# EAGLE design OsciloscopioVersãoFinal (EAGLE 9.4.2)
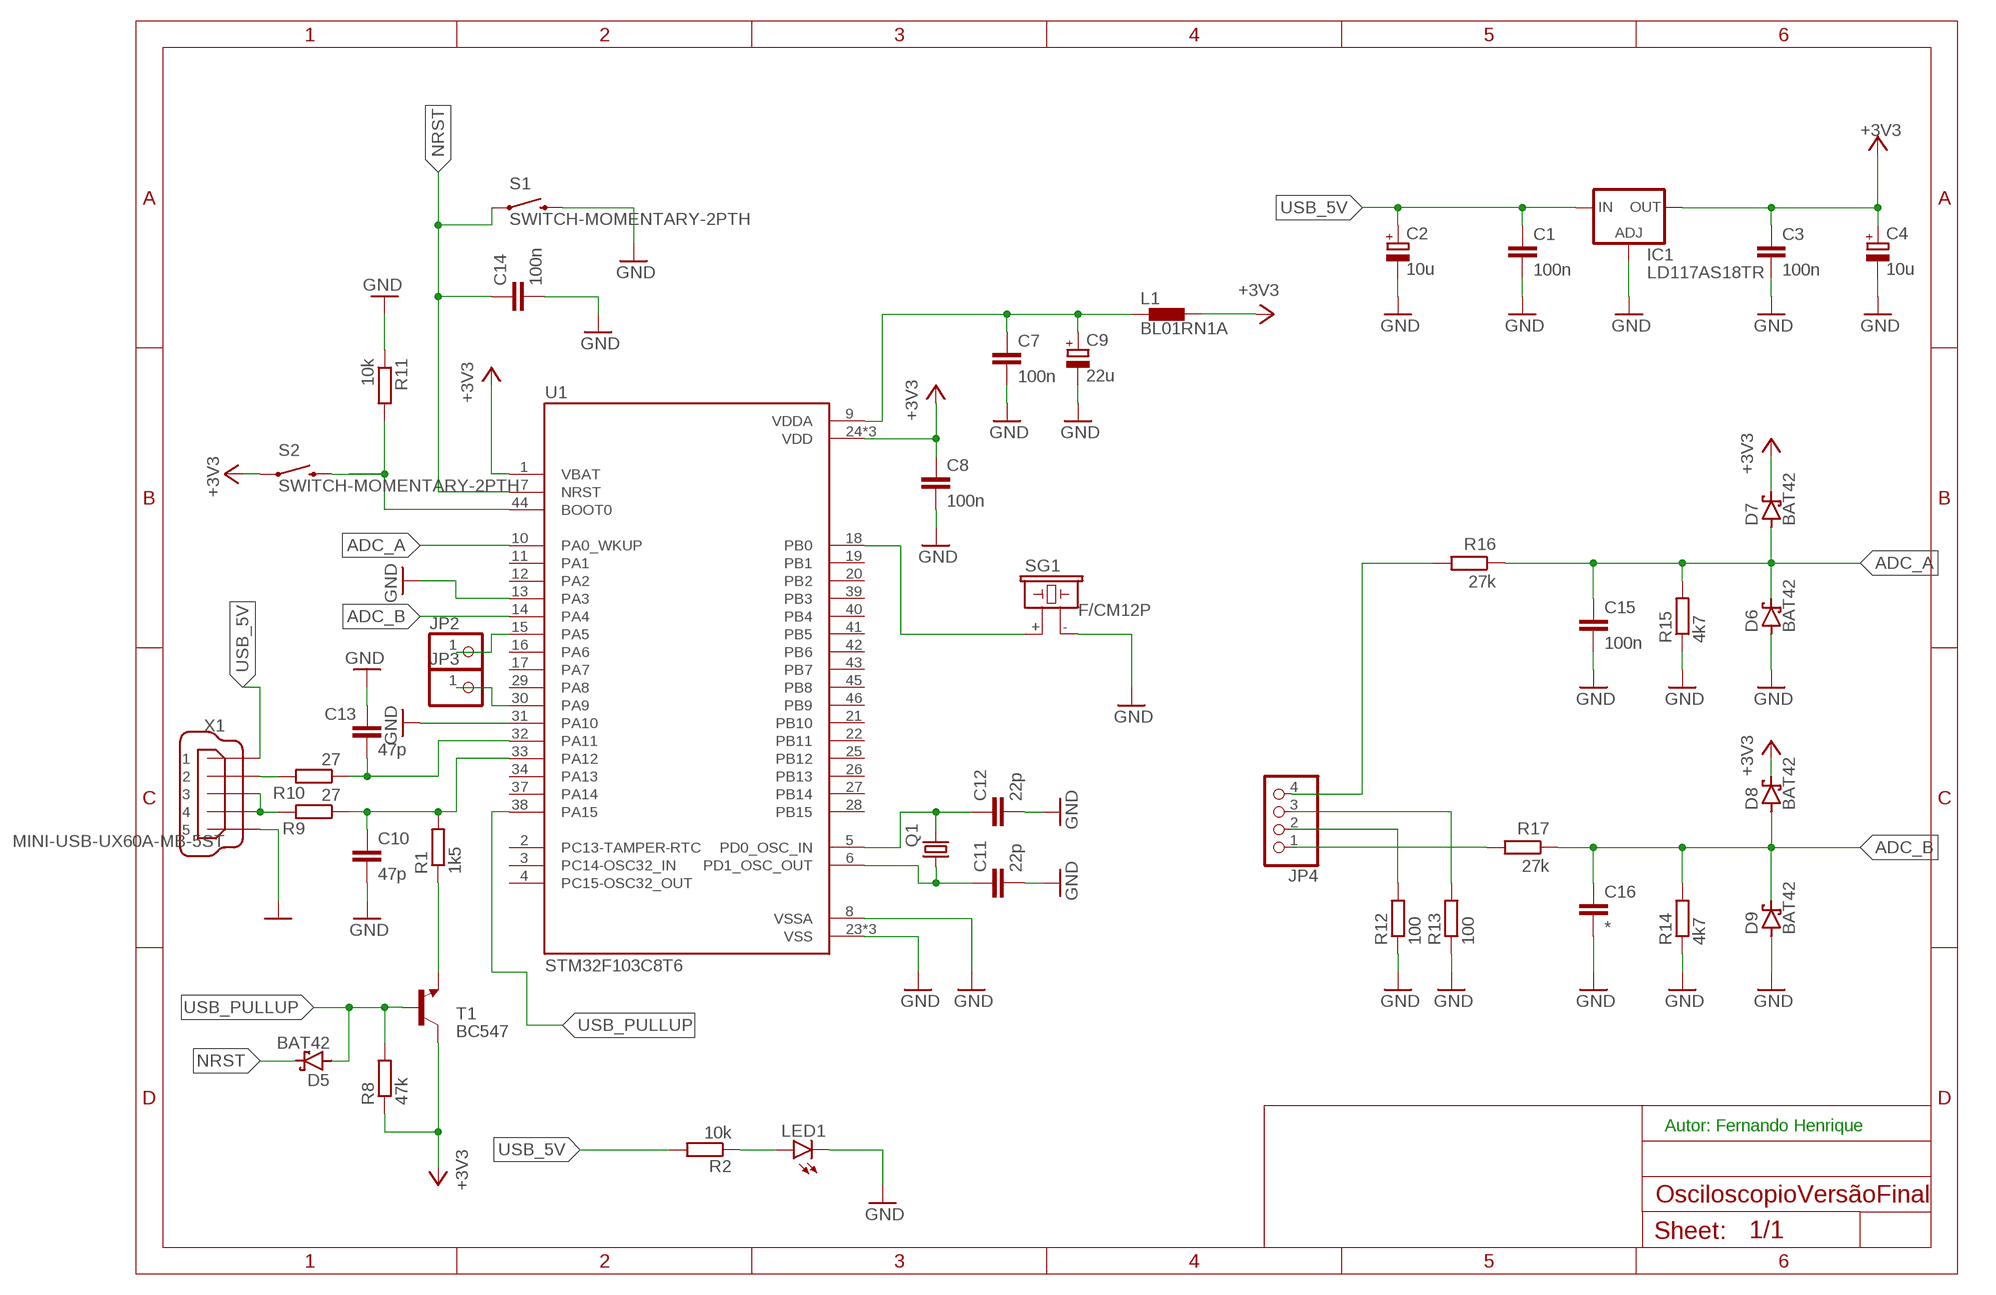
[diagram p0: schematic, sheet 1]

## Parts
C1  100n  C-EUC1206  [C1206]
C2  10u  CPOL-EUB45181B  [B45181B]
C3  100n  C-EUC1206  [C1206]
C4  10u  CPOL-EUB45181B  [B45181B]
C7  100n  C-EUC1206  [C1206]
C8  100n  C-EUC1206  [C1206]
C9  22u  CPOL-EUB45181B  [B45181B]
C10  47p  C-EUC1206  [C1206]
C11  22p  C-EUC1206  [C1206]
C12  22p  C-EUC1206  [C1206]
C13  47p  C-EUC1206  [C1206]
C14  100n  C-EUC1206  [C1206]
C15  100n  C-EUC1206  [C1206]
C16  *  C-EUC1206  [C1206]
D5  BAT42  [DO35-10]
D6  BAT42  [DO35-10]
D7  BAT42  [DO35-10]
D8  BAT42  [DO35-10]
D9  BAT42  [DO35-10]
IC1  LD117AS18TR  [SOT223]
JP2  PINHD-1X1  [1X01]
JP3  PINHD-1X1  [1X01]
JP4  PINHD-1X4  [1X04]
L1  BL01RN1A  [BL01RN1A]
LED1  LED3MM  [LED3MM]
Q1  CRYSTALHC49U-V  [HC49U-V]
R1  1k5  R-EU_R1206  [R1206]
R2  10k  R-EU_R1206  [R1206]
R8  47k  R-EU_R1206  [R1206]
R9  27  R-EU_R1206  [R1206]
R10  27  R-EU_R1206  [R1206]
R11  10k  R-EU_R1206  [R1206]
R12  100  R-EU_R1206  [R1206]
R13  100  R-EU_R1206  [R1206]
R14  4k7  R-EU_R1206  [R1206]
R15  4k7  R-EU_R1206  [R1206]
R16  27k  R-EU_R1206  [R1206]
R17  27k  R-EU_R1206  [R1206]
S1  SWITCH-MOMENTARY-2PTH  [TACTILE-PTH]
S2  SWITCH-MOMENTARY-2PTH  [TACTILE-PTH]
SG1  F/CM12P  [F/CM12P]
T1  BC547  [TO92]
U1  STM32F103C8T6  [QFP50P900X900X160-48N]
X1  MINI-USB-UX60A-MB-5ST  [UX60A-MB-5ST]

## Nets
+3V3: C3.1 C4.+ C8.1 D7.C D8.C IC1.4(OUT) L1.2 R8.1 S2.1 T1.3(C) U1.1(VBAT) U1.24(VDD) U1.36(VDD) U1.48(VDD)
ADC_A: C15.1 D6.C D7.A R15.2 R16.1 U1.10(PA0_WKUP)
ADC_B: C16.1 D8.A D9.C R14.2 R17.1 U1.14(PA4)
GND: C1.2 C2.- C3.2 C4.- C7.2 C8.2 C9.- C10.2 C11.2 C12.2 C13.1 C14.2 C15.2 C16.2 D6.A D9.A IC1.1(ADJ) LED1.K(C) R11.1 R12.1 R13.1 R14.1 R15.1 S1.3 SG1.- U1.8(VSSA) U1.13(PA3) U1.23(VSS) U1.31(PA10) U1.35(VSS) U1.47(VSS) X1.5
N$1: LED1.A R2.1
N$5: SG1.+ U1.18(PB0)
N$6: C13.2 R10.1 U1.32(PA11)
N$7: C10.1 R1.2 R9.1 U1.33(PA12)
N$8: C7.1 C9.+ L1.1 U1.9(VDDA)
N$9: C11.1 Q1.1 U1.6(PD1_OSC_OUT)
N$10: C12.1 Q1.2 U1.5(PD0_OSC_IN)
N$11: R1.1 T1.1(E)
N$12: R10.2 X1.2
N$13: R9.2 X1.3 X1.4
N$14: JP2.1 U1.15(PA5)
N$15: JP3.1 U1.30(PA9)
N$16: R11.2 S2.3 U1.44(BOOT0)
N$17: JP4.1 R17.2
N$18: JP4.2 R12.2
N$19: JP4.3 R13.2
N$20: JP4.4 R16.2
NRST: C14.1 D5.C S1.1 U1.7(NRST)
USB_5V: C1.1 C2.+ IC1.3(IN) R2.2 X1.1
USB_PULLUP: D5.A R8.2 T1.2(B) U1.38(PA15)
Unconnected: U1.2(PC13-TAMPER-RTC) U1.3(PC14-OSC32_IN) U1.4(PC15-OSC32_OUT) U1.11(PA1) U1.12(PA2) U1.16(PA6) U1.17(PA7) U1.19(PB1) U1.20(PB2) U1.21(PB10) U1.22(PB11) U1.25(PB12) U1.26(PB13) U1.27(PB14) U1.28(PB15) U1.29(PA8) U1.34(PA13) U1.37(PA14) U1.39(PB3) U1.40(PB4) U1.41(PB5) U1.42(PB6) U1.43(PB7) U1.45(PB8) U1.46(PB9)

## Notes on the sheet
- Autor: Fernando Henrique

## Library data of the parts
C1 C3 C7 C8 C10-C16 = rcl:C-EU: CAPACITOR, European symbol; SPICEPREFIX: C
C2 C4 C9 = rcl:CPOL-EU: POLARIZED CAPACITOR, European symbol; SPICEPREFIX: C
D5-D9 = diode:BAT42: DIODE barrier diode
IC1 = v-reg:LD117A?*: Low drop fixed and adjustable positive voltage regulators 1 A Source: http://www.st.com/stonline/products/literature/ds/7194/ld1117axx.pdf
JP2 JP3 = pinhead:PINHD-1X1: PIN HEADER
JP4 = pinhead:PINHD-1X4: PIN HEADER
L1 = inductors:BL0: Noise Suppression Products/EMI Suppression Filters, Lead EMIFIL(R) Inductor Type Source: http://www.murata.com .. BL01RN1_DS.pdf
LED1 = led:LED: LED OSRAM: - CHIPLED LG R971, LG N971, LY N971, LG Q971, LY Q971, LO R971, LY R971 LH N974, LH R974 LS Q976, LO Q976, LY Q976 LO Q996 - Hyper CHIPLED LW Q18S LB Q993, LB Q99A, LB R99A - SideLED LS A670, LO A670, LY A670, LG A670, LP A670 LB A673, LV A673, LT A673, LW A673 LH A674 LY A675 LS A676, LA A676, LO A676, LY A676, LW A676 LS A679, LY A679, LG A679 - Hyper Micro SIDELED® LS Y876, LA Y876, LO Y876, LY Y876 LT Y87S - SmartLED LW L88C, LW L88S LB L89C, LB L89S, LG L890 LS L89K, LO L89K, LY L89K LS L896, LA L896, LO L896, LY L896 - TOPLED LS T670, LO T670, LY T670, LG T670, LP T670 LSG T670, LSP T670, LSY T670, LOP T670, LYG T670 LG T671, LOG T671, LSG T671 LB T673, LV T673, LT T673, LW T673 LH T674 LS T676, LA T676, LO T676, LY T676, LB T676, LH T676, LSB T676, LW T676 LB T67C, LV T67C, LT T67C, LS T67K, LO T67K, LY T67K, LW E67C LS E67B, LA E67B, LO E67B, LY E67B, LB E67C, LV E67C, LT E67C LW T67C LS T679, LY T679, LG T679 LS T770, LO T770, LY T770, LG T770, LP T770 LB T773, LV T773, LT T773, LW T773 LH T774 LS E675, LA E675, LY E675, LS T675 LS T776, LA T776, LO T776, LY T776, LB T776 LHGB T686 LT T68C, LB T68C - Hyper Mini TOPLED® LB M676 - Mini TOPLED Santana® LG M470 LS M47K, LO M47K, LY M47K Source: http://www.osram.convergy.de LUXEON: - LUMILED® LXK2-PW12-R00, LXK2-PW12-S00, LXK2-PW14-U00, LXK2-PW14-V00 LXK2-PM12-R00, LXK2-PM12-S00, LXK2-PM14-U00 LXK2-PE12-Q00, LXK2-PE12-R00, LXK2-PE12-S00, LXK2-PE14-T00, LXK2-PE14-U00 LXK2-PB12-K00, LXK2-PB12-L00, LXK2-PB12-M00, LXK2-PB14-N00, LXK2-PB14-P00, LXK2-PB14-Q00 LXK2-PR12-L00, LXK2-PR12-M00, LXK2-PR14-Q00, LXK2-PR14-R00 LXK2-PD12-Q00, LXK2-PD12-R00, LXK2-PD12-S00 LXK2-PH12-R00, LXK2-PH12-S00 LXK2-PL12-P00, LXK2-PL12-Q00, LXK2-PL12-R00 Source: www.luxeon.com KINGBRIGHT: KA-3528ASYC Source: www.kingbright.com
Q1 = crystal:CRYSTAL: CRYSTAL; OC_FARNELL: 1666969; OC_NEWARK: unknown
R1 R2 R8-R17 = rcl:R-EU_: RESISTOR, European symbol; SPICEPREFIX: R
S1 S2 = SparkFun-Electromechanical:SWITCH-MOMENTARY-2: Various NO switches- pushbuttons, reed, etc; PROD_ID: SWCH-08441
SG1 = buzzer:F/CM12P: BUZZER Source: Buerklin; OC_FARNELL: unknown; OC_NEWARK: unknown
T1 = transistor:BC547: NPN TRANSISTOR
U1 = STM32F103C8T6:STM32F103C8T6: Mainstream Performance line, ARM Cortex-M3 MCU with 64 Kbytes Flash, 72 MHz CPU, motor control, USB and CAN; DESCRIPTION: Mainstream Performance line, ARM Cortex-M3 MCU with 64 Kbytes Flash, 72 MHz CPU, motor control, USB and CAN; DIGI-KEY_PART_NUMBER: 497-6063-ND; DIGI-KEY_PURCHASE_URL: https://www.digikey.com.br/product-detail/en/stmicroelectronics/STM32F103C8T6/497-6063-ND/1646338?utm_source=snapeda&utm_medium=aggregator&utm_campaign=symbol; MF: STMicroelectronics; MP: STM32F103C8T6; PACKAGE: LQFP-48 STMicroelectronics
X1 = con-hirose:MINI-USB-: MINI USB Connector Source: http://www.hirose.co.jp/cataloge_hp/e24000019.pdf; OC_FARNELL: unknown; OC_NEWARK: unknown

## Board
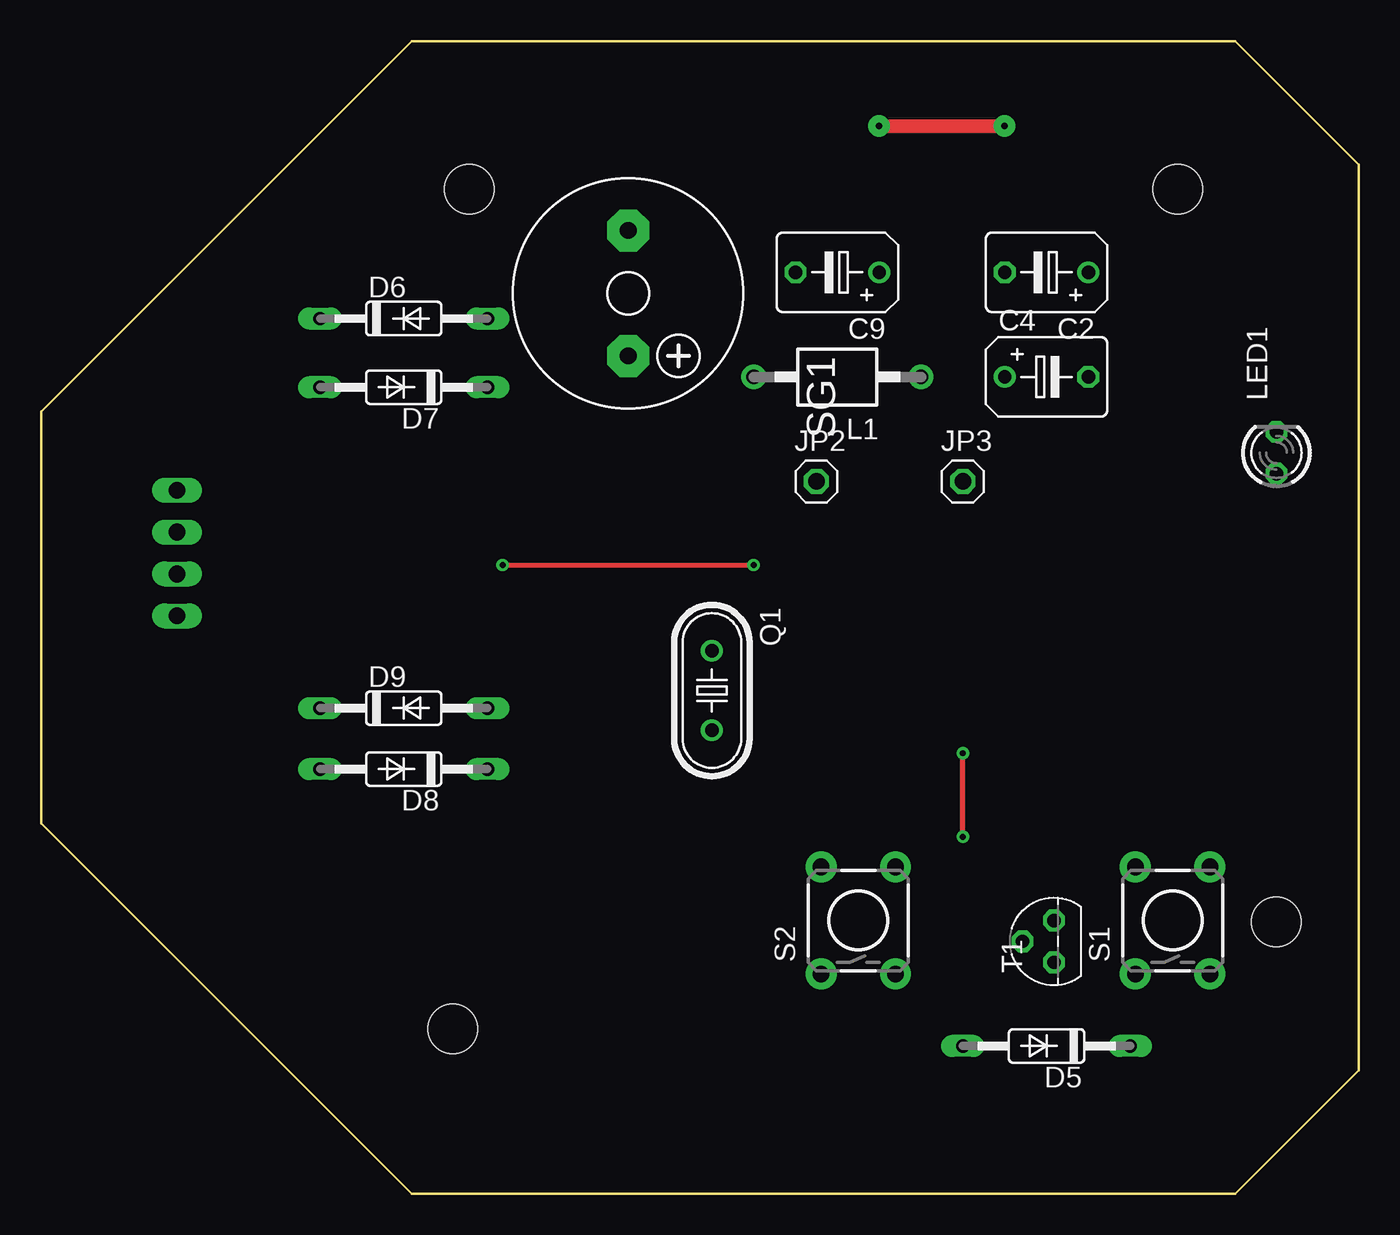
[diagram p1: board, top side]
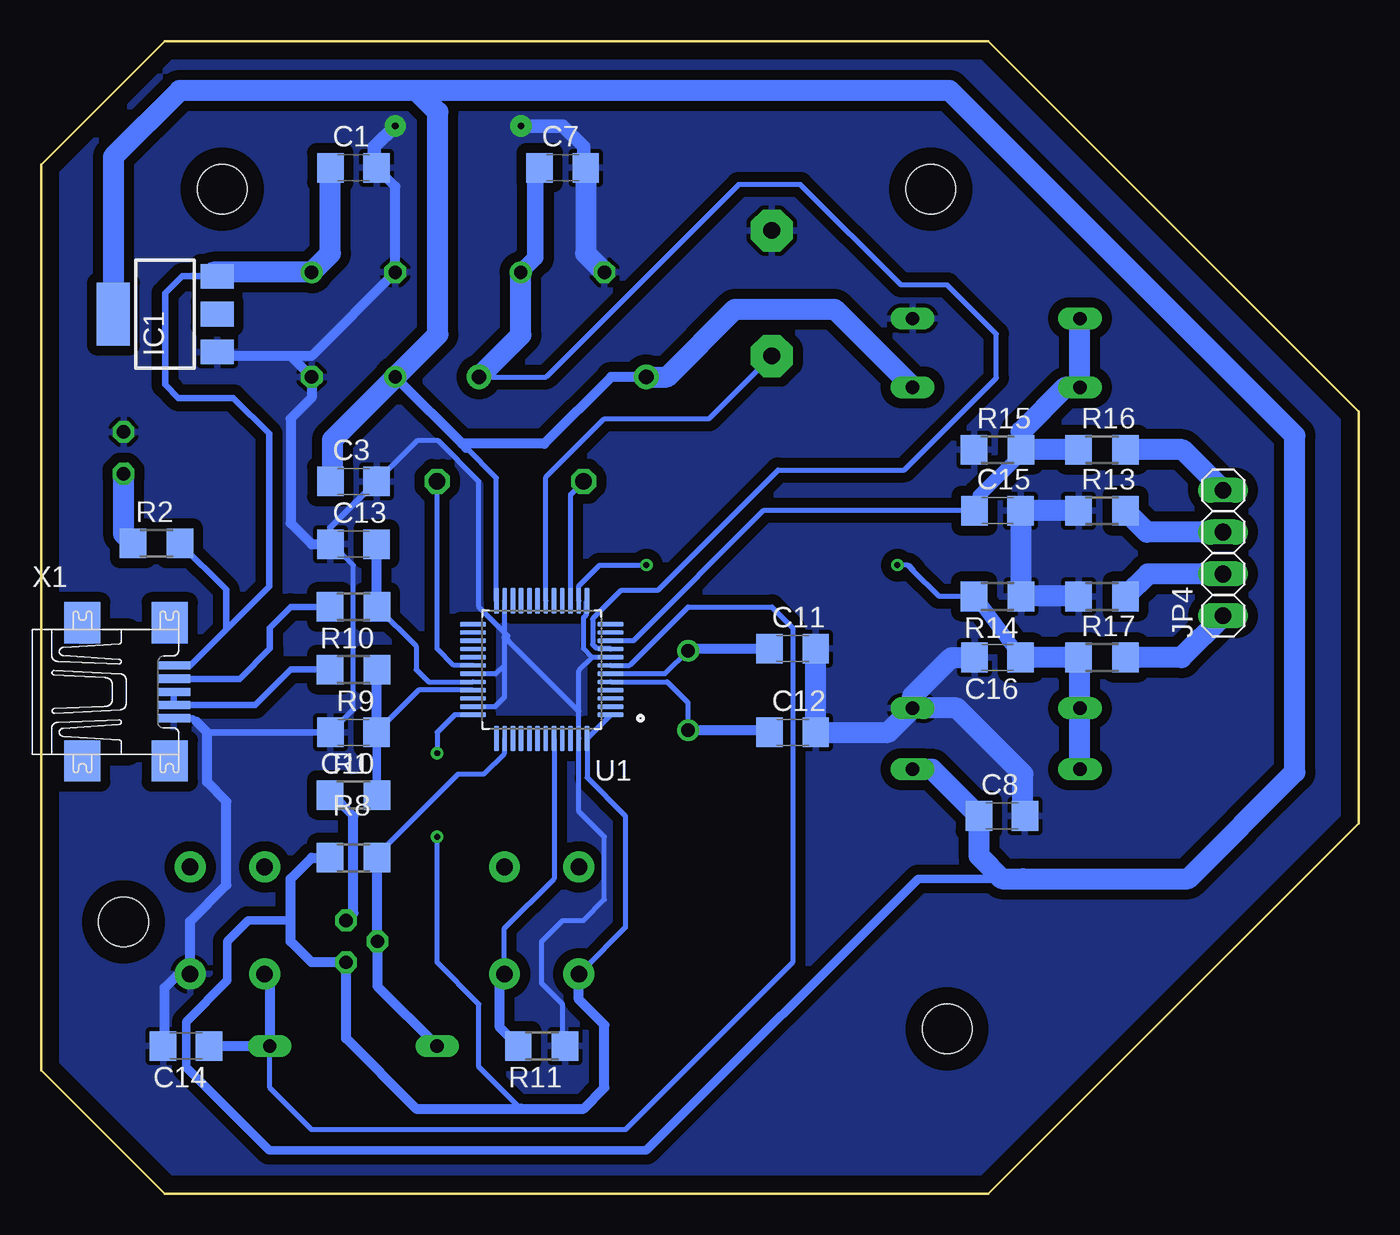
[diagram p2: board, bottom side, seen from below]

Size 80 x 70 mm. Coordinates in mm from the lower left corner, seen from the top.
Outline: 0,47.5 0,22.5 22.5,0 72.5,0 80,7.5 80,62.5 72.5,70 22.5,70 0,47.5
Copper layers (1*16): Top 0.035mm / dielectric 1.5mm / Bottom 0.035mm
Design rules "default": minimum track width 6mil, minimum drill 0.35mm, track to track 6mil, track to pad 6mil, pad to pad 6mil, via to via 6mil, smd to smd 6mil, copper to edge 40mil, drill to drill 6mil, minimum pad ring 10mil, minimum via ring 8mil, stop-mask expansion 4mil, vias tented up to drill 0mil, thermal gap 10mil
Holes 3 mm at 26,61 25,10 69,61 75,16.5

### Footprints (pad centres in the part's own frame; a part is rotated, then mirrored left to right if it is on the bottom)
C1206 = smd 1.6 x 1.8: 1 -1.4,0; 2 1.4,0
B45181B = drill 0.813: + -2.54,0 | drill 0.813 octagon: - 2.54,0
DO35-10 = drill 0.813 long: A 5.08,0; C -5.08,0
SOT223 = smd 1.5 x 2: 1 -2.3,-3.15; 2 0,-3.15; 3 2.3,-3.15 | smd 3.8 x 2: 4 0,3.15
1X01 = drill 1.016 octagon: 1 0,0
1X04 = drill 1.016 long: 1 -3.81,0; 2 -1.27,0; 3 1.27,0; 4 3.81,0
BL01RN1A = drill 0.9 pad 1.5: 1 -5.08,0; 2 5.08,0
LED3MM = drill 0.813 octagon: A -1.27,0; K 1.27,0
HC49U-V = drill 0.813: 1 -2.413,0; 2 2.413,0
R1206 = smd 1.6 x 1.803: 1 -1.422,0; 2 1.422,0
TACTILE-PTH = drill 1.016 pad 1.88: 1 -3.251,2.261; 2 3.251,2.261; 3 -3.251,-2.261; 4 3.251,-2.261
F/CM12P = drill 1.016 pad 2.54 octagon: + 3.81,0; - -3.81,0
TO92 = drill 0.813 octagon: 1 1.27,0; 2 0,1.905; 3 -1.27,0
QFP50P900X900X160-48N = smd 1.56 x 0.28: 1 -4.18,2.75; 2 -4.18,2.25; 3 -4.18,1.75; 4 -4.18,1.25; 5 -4.18,0.75; 6 -4.18,0.25; 7 -4.18,-0.25; 8 -4.18,-0.75; 9 -4.18,-1.25; 10 -4.18,-1.75; 11 -4.18,-2.25; 12 -4.18,-2.75; 25 4.18,-2.75; 26 4.18,-2.25; 27 4.18,-1.75; 28 4.18,-1.25; 29 4.18,-0.75; 30 4.18,-0.25; 31 4.18,0.25; 32 4.18,0.75; 33 4.18,1.25; 34 4.18,1.75; 35 4.18,2.25; 36 4.18,2.75 | smd 0.28 x 1.56: 13 -2.75,-4.18; 14 -2.25,-4.18; 15 -1.75,-4.18; 16 -1.25,-4.18; 17 -0.75,-4.18; 18 -0.25,-4.18; 19 0.25,-4.18; 20 0.75,-4.18; 21 1.25,-4.18; 22 1.75,-4.18; 23 2.25,-4.18; 24 2.75,-4.18; 37 2.75,4.18; 38 2.25,4.18; 39 1.75,4.18; 40 1.25,4.18; 41 0.75,4.18; 42 0.25,4.18; 43 -0.25,4.18; 44 -0.75,4.18; 45 -1.25,4.18; 46 -1.75,4.18; 47 -2.25,4.18; 48 -2.75,4.18
UX60A-MB-5ST = smd 2 x 0.5: 1 2.25,1.6; 2 2.25,0.8; 3 2.25,0; 4 2.25,-0.8; 5 2.25,-1.6 | smd 2.2 x 2.5: M1 -3.3,-4.2; M2 -3.3,4.2; M3 2,4.2; M4 2,-4.2

### Placement (x,y rotation side)
C1  61.04,62.31 0 bottom
C2  61.04,55.96 180 top
C3  61.04,43.26 0 bottom
C4  61.04,49.61 0 top
C7  48.34,62.31 0 bottom
C8  21.67,22.94 0 bottom
C9  48.34,55.96 180 top
C10  61.04,28.02 180 bottom
C11  34.37,33.1 0 bottom
C12  34.37,28.02 0 bottom
C13  61.04,39.45 0 bottom
C14  71.2,8.97 180 bottom
C15  21.93,41.48 0 bottom
C16  21.93,32.57 180 bottom
D5  61.04,8.97 180 top
D6  22.01,53.15 0 top
D7  22.01,48.98 180 top
D8  22.01,25.79 180 top
D9  22.01,29.49 0 top
IC1  72.47,53.42 90 bottom
JP2  47.07,43.26 0 top
JP3  55.96,43.26 0 top
JP4  8.24,38.91 90 bottom
L1  48.34,49.61 180 top
LED1  75,45 90 top
Q1  40.72,30.56 270 top
R1  61.04,24.21 0 bottom
R2  73,39.5 0 bottom
R8  61.04,20.4 0 bottom
R9  61.04,31.83 180 bottom
R10  61.04,35.64 180 bottom
R11  49.61,8.97 180 bottom
R12  15.59,36.27 0 bottom
R13  15.59,41.48 0 bottom
R14  21.93,36.27 180 bottom
R15  21.93,45.19 0 bottom
R16  15.59,45.19 0 bottom
R17  15.59,32.57 0 bottom
S1  68.7,16.59 90 top
S2  49.61,16.59 90 top
SG1  35.64,54.69 270 top
T1  61.49,15.32 90 top
U1  49.61,31.83 180 bottom
X1  74.2,30.47 0 bottom

### Tracks (layer width: path | path; a pad name or v marks a point on that pad's centre or on a via)
+3V3  (via drill 0.35)
  Top 0.305: v55.96,21.67 v55.96,26.75
  Bottom 0.305: U1.24 52.36,43.47 54.2,45.31 54.45,45.56 | 47.07,13.62 44.53,16.16 44.53,22.94 46.86,25.27 U1.48 U1.1 | 50.88,5.16 53.42,7.7 53.42,11.51 55.96,14.05 v55.96,21.67 | U1.36 54.9,29.08 55.96,28.02 v55.96,26.75
  Bottom 0.508: 20.4,19.13 26.75,19.13 43.26,2.62 66.16,2.62 71.21,7.67 71.21,10.44 68.7,12.94 68.7,15.32 67.43,16.59 64.89,16.59 64.85,16.63
  Bottom 0.61: R8.1 63.58,20.4 64.85,19.13 64.85,16.63 64.85,15.32 63.58,14.05 T1.3 61.49,9.42 57.23,5.16 50.88,5.16 47.07,5.16 45.8,6.43 45.8,10.24 47.35,11.79 S2.1 47.07,13.62 | L1.2 45.39,49.61 49.45,45.56 54.45,45.56 | 54.2,45.31 C4.+
  Bottom 1.27: C3.1 62.31,43.39 62.31,45.8 C4.+ 55.92,52.19 55.92,65.69 57.23,67 | L1.2 41.99,49.61 37.88,53.72 31.83,53.72 D7.C | 57.23,67 71.59,67 75.62,62.97 IC1.4 | 57.23,67 24.85,67 3.89,46.04 3.89,25.6 10.36,19.13 20.4,19.13 21.67,19.13 23.07,20.53 C8.1 25.92,25.79 D8.C
ADC_A
  Bottom 0.305: U1.10 44.05,33.58 36.15,41.48 C15.1
  Bottom 0.61: C15.1 23.45,41.48
  Bottom 0.813: C15.1 23.05,41.2 23.05,42.39 20.51,44.94 R15.2
  Bottom 1.27: R16.1 R15.2 20.51,46.29 17.82,48.98 D7.A D6.C
ADC_B  (via drill 0.35)
  Top 0.305: v28.02,38.18 v43.26,38.18
  Bottom 0.305: 23.36,36.39 R14.2 25.48,36.27 27.07,37.86 | U1.14 47.36,36.91 46.09,38.18 v43.26,38.18 | 27.34,38.13 27.39,38.18 v28.02,38.18 | 27.07,37.86 27.34,38.13 | 27.34,38.13 27.34,38.18 27.07,37.91 27.07,37.86
  Bottom 0.813: R17.1 17.87,32.56 | 17.87,32.56 C16.1 23.36,36.39 | D9.C 16.93,31.63 17.87,32.56
  Bottom 1.27: C16.1 R17.1 16.93,32.49 D9.C D8.A
GND  (via drill 0.4 pad 1.3)
  Top 0.813: v50.88,64.85 v58.5,64.85
  Bottom 0.305: U1.13 46.9,35.97 46.9,35.16 47.07,34.99 47.07,33.1 46.55,32.58 | R11.1 48.34,9.12 48.34,11.51 49.61,12.78 49.61,15.32 48.34,16.59 47.07,16.59 45.8,17.86 45.8,21.67 47.36,23.23 U1.47 47.36,29.29 | 47.36,29.29 47.36,31.77 46.55,32.58 | U1.8 46.55,32.58 | U1.31 52.4,31.58 51.86,32.12 | U1.35 52.44,29.58 51.86,30.16 51.86,32.12 | 47.36,29.29 51.66,33.59 51.66,33.88 53.42,35.64 53.42,43.26 55.9,45.73 57.16,45.73 59.7,43.19 | U1.23 51.86,33.79 51.86,32.12 | C10.2 61.04,29.42 61.04,38.18 62.31,39.45 C13.1
  Bottom 0.406: X1.5 70.78,28.87 70.56,28.66 | C10.2 69.93,28.02 | C3.2 59.7,43.19 62.44,40.46 C13.1 | 51.86,33.79 51.66,33.59
  Bottom 0.61: 70.56,28.66 69.93,28.02 69.93,25 68.75,23.82 68.75,18.75 70.96,16.54 S1.3 71.66,13.34 72.5,12.5 72.5,9.07 C14.2 | IC1.1 69.69,51.12 69.93,50.88 64.85,50.88 | 64.85,50.88 C4.- 63.58,48.34 64.85,47.07 64.85,40.72 63.58,39.45 C13.1 | C1.2 58.5,61.17 C2.- 63.58,50.88 64.85,50.88
  Bottom 0.813: 20.53,36.29 R14.1 R12.1 | 47.07,62.44 47.07,63.58 48.34,64.85 v50.88,64.85 | 59.77,62.44 59.77,63.58 v58.5,64.85
  Bottom 1.27: R13.1 C15.2 20.51,41.46 R14.1 | R12.1 17.03,36.29 20.53,36.29 | D9.A 27.09,30.22 24.75,32.56 C16.2 | C9.- 46.94,57.1 C7.2 47.07,62.44 | C11.2 C12.2 28.56,28.02 D9.A | C8.2 20.4,23.07 20.4,25.48 24.41,29.49 D9.A | C1.2 59.77,62.44
  pour Bottom (isolate 0.61): 0,47.5 0,22.5 22,0.5 73,0.5 80,7.5 80,62.5 72,70.5 23,70.5
N$1
  Bottom 1.27: R2.1 75,40.08 LED1.A
N$5
  Bottom 0.305: U1.18 49.36,43.51 45.8,47.07 39.45,47.07 SG1.+
N$6
  Bottom 0.305: R10.1 57.23,33.25 57.23,31.83 56.48,31.08 U1.32
  Bottom 0.61: C13.2 59.64,35.66 R10.1
N$7
  Bottom 0.305: U1.33 57.08,30.58 59.62,28.04
  Bottom 0.406: R9.1 59.62,28.73 59.16,28.27 59.16,27.62
  Bottom 0.508: R1.2 59.62,28 C10.1
  Bottom 0.61: C10.1 59.62,28.04 R9.1
N$8
  Bottom 0.305: L1.1 49.34,49.61 37.66,61.29 33.9,61.29 27.8,55.18 24.98,55.18 22.01,52.21 22.01,49.54 27.6,43.95 35.25,43.95 42.54,36.66 44.78,36.66 46.45,34.99 46.45,34.97 46.52,34.9 46.52,33.36 46.28,33.12 45.47,33.12 U1.9
  Bottom 1.016: C7.1 50,62.05 50,56.84 C9.+
  Bottom 1.27: L1.1 50.88,52.15 C9.+
N$9
  Bottom 0.305: U1.6 42.11,31.58 Q1.1
  Bottom 0.61: C11.1 40.59,33.1 Q1.1
N$10
  Bottom 0.305: U1.5 41.99,31.08 40.72,29.81 Q1.2
  Bottom 0.61: C12.1 35.9,28.15 Q1.2
N$11
  Bottom 0.508: 61.04,22.94 62.31,24.21 R1.1
  Bottom 0.61: T1.1 61.04,17.04 61.04,22.94
N$12
  Bottom 0.406: X1.2 67.95,31.27 66.12,33.1 66.12,34.37 64.85,35.64 R10.2
N$13
  Bottom 0.406: X1.3 X1.4 67.01,29.67 64.85,31.83 R9.2
N$14
  Bottom 0.305: U1.15 47.86,42.47 JP2.1
N$15
  Bottom 0.305: U1.30 54.94,32.08 55.96,33.1 JP3.1
N$16
  Bottom 0.305: U1.44 48.86,19.13 51.87,16.12 S2.3
  Bottom 0.61: R11.2 52.15,10.09 52.15,13.06 S2.3
N$17
  Bottom 1.27: JP4.1 10.78,32.56 R17.2
N$18
  Bottom 1.27: JP4.2 12.8,37.64 R12.2
N$19
  Bottom 1.27: JP4.3 12.87,40.18 R13.2
N$20
  Bottom 1.27: JP4.4 10.71,45.19 R16.2
NRST
  Bottom 0.305: D5.C 66.12,6.43 63.58,3.89 44.53,3.89 34.37,14.05 34.37,34.37 35.64,35.64 40.72,35.64 44.28,32.08 U1.7
  Bottom 0.61: S1.1 66.12,13.34 D5.C C14.1
USB_5V
  Bottom 0.406: X1.1 70.96,32.07 68.77,34.27 | 68.77,34.27 68.27,34.77 66.16,36.87 66.16,46.16 68.33,48.33 71.67,48.33 72.47,49.13 72.47,54.69 71.44,55.72 IC1.3 | R2.2 68.77,36.69 68.77,34.27
  Bottom 0.61: 69.08,55.96 IC1.3 69.56,55.96
  Bottom 1.27: C1.1 62.44,57.1 C2.+ 69.56,55.96
USB_PULLUP
  Bottom 0.305: U1.38 51.86,26.75 53.13,25.48 54.69,25.48 59.59,20.58 59.59,20.37
  Bottom 0.61: D5.A 59.59,12.6 T1.2 59.59,20.37 R8.2